# Altium project MOTION_BOARD.PrjPcb (part 2 of 2)

## Sheet DSP.SchDoc: DSP
size A2; ApprovedBy: Yves Chevallier; CheckedBy: Yves Chevallier; Author: Yves Chevallier; CompanyName: EPFL; DrawnBy: Yves Chevallier; Engineer: Yves Chevallier; Organization: EPFL; Address1: EPFL; Address2: CH1015 Lausanne; Address3: +41(0)21 693 36 98; Address4: +41(0)21 693 26 00; DocumentNumber: ABC.00.0000.000.0; Revision: v1.0; SheetNumber: 0; SheetTotal: 0; DrawnByDate: 2000-01-01; ExecutionWarrantDate: 2000-01-01; ExecutionWarrant: Yves Chevallier; Context: Confidential; PageSetup: Record=PageOptions|CenterHorizontal=True|CenterVertical=False|PrintScale=0.97|XCorrection=1.00|YCorrection=1.00|PrintKind=0|BorderSize=5000000|LeftOffset=0|BottomOffset=0|Orientation=2|PaperLength=1000|PaperWidth=1000|Scale=100|PaperSource=262|PrintQuality=600|MediaType=1|DitherType=10|PaperKind=A4|PrintScaleMode=1; EngineerDate: 2000-01-01; CheckedByDate: 2000-01-01; ProjectName: PRJ
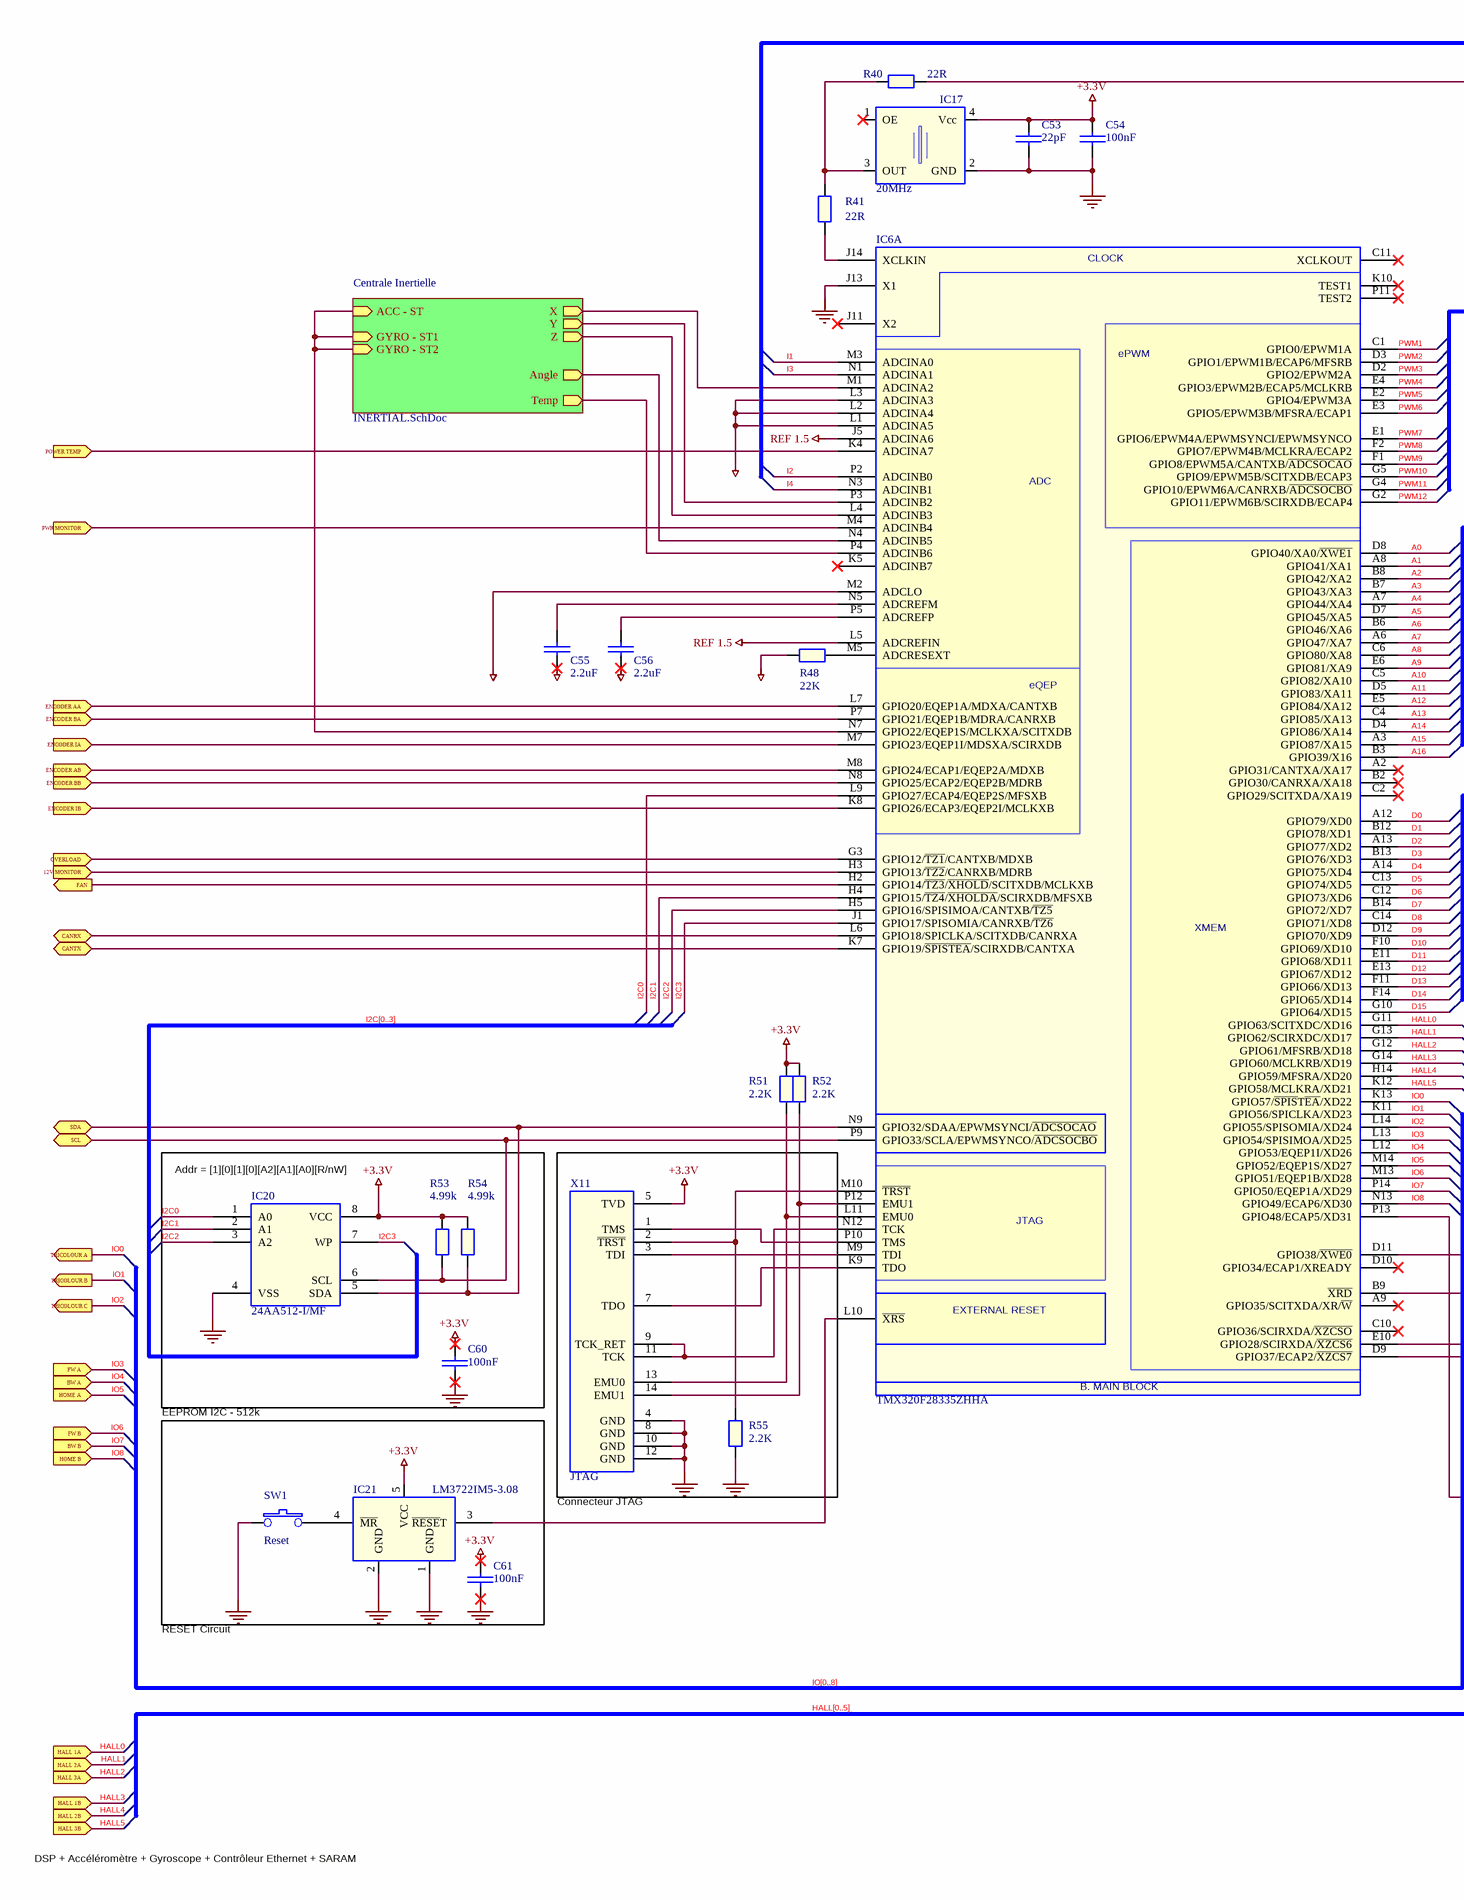
[diagram p5: DSP.SchDoc, left]
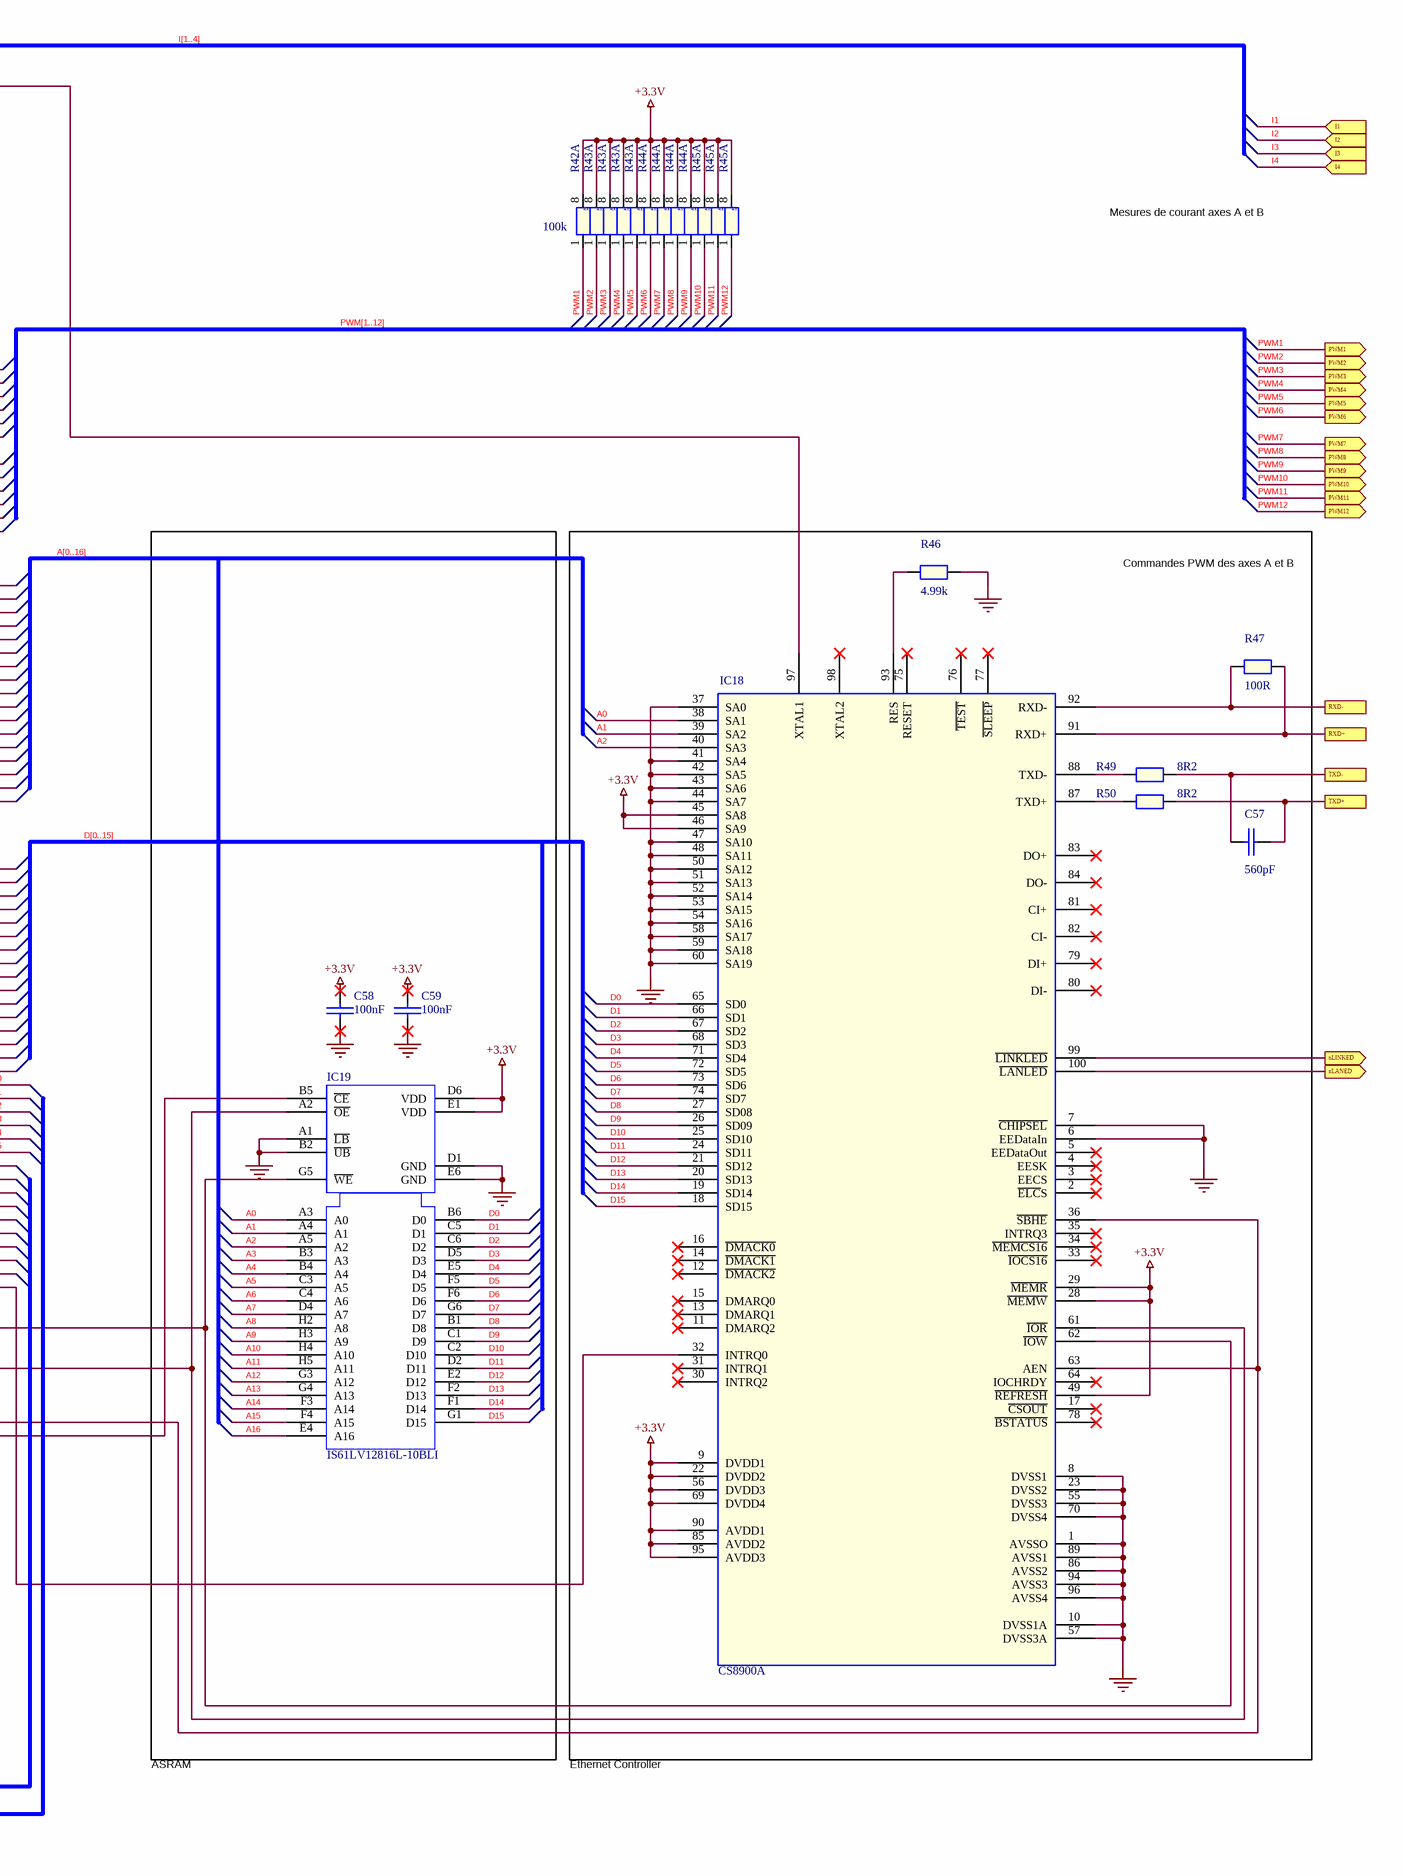
[diagram p6: DSP.SchDoc, right]

### Parts
(Parts that share a designator on the sheet are numbered #1, #2 ... from top to bottom, then left to right.)
C53  22pF  [SM/C_0805]
C54  100nF  [SM/C_0805]
C55  2.2uF  [SM/C_0805]
C56  2.2uF  [SM/C_0805]
C57  560pF  [SM/C_0805]
C58  100nF  [SM/C_0805]
C59  100nF  [SM/C_0805]
C60  100nF  [SM/C_0805]
C61  100nF  [SM/C_0805]
IC6  TMX320F28335ZHHA  [HEIG/BGA/MICROSTAR/S-PBGA-N179]  (part A of 2)
IC17  20MHz  [HEIG/OSC/SPX0/SG-310]
IC18  CS8900A  [QUAD.50M/100/WG16.00]
IC19  IS61LV12816L-10BLI  [HEIG/BGA/0.8/6H/48/6X8]
IC20  24AA512-I/MF  [HEIG/DFN/8/6X5]
IC21  LM3722IM5-3.08  [HEIG/SM/SOT23-5]
R40  22R  [R400]
R41  22R  [R400]
R42  100k  [RESEAU_CAY16_710958]  (part A of 4)
R43#1  R 4x  [RESEAU_CAY16_710958]  (value not drawn)  (part A of 4)
R43#2  R 4x  [RESEAU_CAY16_710958]  (value not drawn)  (part A of 4)
R43#3  R 4x  [RESEAU_CAY16_710958]  (value not drawn)  (part A of 4)
R43#4  R 4x  [RESEAU_CAY16_710958]  (value not drawn)  (part A of 4)
R44#1  R 4x  [RESEAU_CAY16_710958]  (value not drawn)  (part A of 4)
R44#2  R 4x  [RESEAU_CAY16_710958]  (value not drawn)  (part A of 4)
R44#3  R 4x  [RESEAU_CAY16_710958]  (value not drawn)  (part A of 4)
R44#4  R 4x  [RESEAU_CAY16_710958]  (value not drawn)  (part A of 4)
R45#1  R 4x  [RESEAU_CAY16_710958]  (value not drawn)  (part A of 4)
R45#2  R 4x  [RESEAU_CAY16_710958]  (value not drawn)  (part A of 4)
R45#3  R 4x  [RESEAU_CAY16_710958]  (value not drawn)  (part A of 4)
R46  4.99k  [R400]
R47  100R  [R400]
R48  22K  [R400]
R49  8R2  [R400]
R50  8R2  [R400]
R51  2.2K  [R400]
R52  2.2K  [R400]
R53  4.99k  [R400]
R54  4.99k  [R400]
R55  2.2K  [R400]
SW1  Reset  [PUSHBUTTON_415 6535]
X11  JTAG  [HEIG/CONN/SMT14]

### Blocks framed on the sheet
Commandes PWM des axes A et B: C57 IC18 R46 R47 R49 R50
Addr = [1][0][1][0][A2][A1][A0][R/nW]: C60 IC20 R53 R54
EEPROM I2C - 512k: C61 IC21 SW1

### Sub-sheets
Centrale Inertielle = INERTIAL.SchDoc: X (out), Y (out), Z (out), Angle (out), ACC - ST (in), GYRO - ST1 (in), GYRO - ST2 (in), Temp (out)

### Ports
12V MONITOR (in), BW A (in), BW B (in), CANRX (bidir), CANTX (bidir), ENCODER AA (in), ENCODER AB (in), ENCODER BA (in), ENCODER BB (in), ENCODER IA (in), ENCODER IB (in), FAN (out), FW A (in), FW B (in), HALL 1A (in), HALL 1B (in), HALL 2A (in), HALL 2B (in), HALL 3A (in), HALL 3B (in), HOME A (in), HOME B (in), I1 (in), I2 (in), I3 (in), I4 (in), nLANED (out), nLINKED (out), OVERLOAD (in), POWER TEMP (in), PWM1 (out), PWM2 (out), PWM3 (out), PWM4 (out), PWM5 (out), PWM6 (out), PWM7 (out), PWM8 (out), PWM9 (out), PWM10 (out), PWM11 (out), PWM12 (out), PWR MONITOR (in), RXD+, RXD-, SCL (bidir), SDA (bidir), TRICOLOUR A (out), TRICOLOUR B (out), TRICOLOUR C (out), TXD+, TXD-

### Nets
+3.3V: C53.1 C54.1 C58.1 C59.1 C60.1 C61.1 IC17.4(Vcc) IC18.9(DVDD1) IC18.22(DVDD2) IC18.28(~{MEMW}) IC18.29(~{MEMR}) IC18.45(SA8) IC18.46(SA9) IC18.49(~{REFRESH}) IC18.56(DVDD3) IC18.69(DVDD4) IC18.85(AVDD2) IC18.90(AVDD1) IC18.95(AVDD3) IC19.D6(VDD) IC19.E1(VDD) IC20.8(VCC) IC21.5(VCC) R42.8(B) R43#1.8(B) R43#2.8(B) R43#3.8(B) R43#4.8(B) R44#1.8(B) R44#2.8(B) R44#3.8(B) R44#4.8(B) R45#1.8(B) R45#2.8(B) R45#3.8(B) R51.1 R52.1 R53.1 R54.1 X11.5(TVD)
AGND: C55.2 C56.2 IC6.L1(ADCINA5) IC6.L2(ADCINA4) IC6.L3(ADCINA3) IC6.M2(ADCLO) R48.1
GND: C53.2 C54.2 C58.2 C59.2 C60.2 C61.2 IC6.J13(X1) IC17.2(GND) IC18.1(AVSSO) IC18.6(EEDataIn) IC18.7(~{CHIPSEL}) IC18.8(DVSS1) IC18.10(DVSS1A) IC18.23(DVSS2) IC18.37(SA0) IC18.41(SA4) IC18.42(SA5) IC18.43(SA6) IC18.44(SA7) IC18.47(SA10) IC18.48(SA11) IC18.50(SA12) IC18.51(SA13) IC18.52(SA14) IC18.53(SA15) IC18.54(SA16) IC18.55(DVSS3) IC18.57(DVSS3A) IC18.58(SA17) IC18.59(SA18) IC18.60(SA19) IC18.70(DVSS4) IC18.86(AVSS2) IC18.89(AVSS1) IC18.94(AVSS3) IC18.96(AVSS4) IC19.A1(~{LB}) IC19.B2(~{UB}) IC19.D1(GND) IC19.E6(GND) IC20.4(VSS) IC21.1(GND) IC21.2(GND) R46.2 R55.2 SW1.2 X11.4(GND) X11.8(GND) X11.10(GND) X11.12(GND)
REF 1.5: IC6.J5(ADCINA6) IC6.L5(ADCREFIN)
12V MONITOR: IC6.H3(GPIO13/~{TZ2}/CANRXB/MDRB) ; port 12V MONITOR
A0: IC6.D8(GPIO40/XA0/~{XWE1}) IC18.38(SA1) IC19.A3(A0)
A1: IC6.A8(GPIO41/XA1) IC18.39(SA2) IC19.A4(A1)
A2: IC6.B8(GPIO42/XA2) IC18.40(SA3) IC19.A5(A2)
A3: IC6.B7(GPIO43/XA3) IC19.B3(A3)
A4: IC6.A7(GPIO44/XA4) IC19.B4(A4)
A5: IC6.D7(GPIO45/XA5) IC19.C3(A5)
A6: IC6.B6(GPIO46/XA6) IC19.C4(A6)
A7: IC6.A6(GPIO47/XA7) IC19.D4(A7)
A8: IC6.C6(GPIO80/XA8) IC19.H2(A8)
A9: IC6.E6(GPIO81/XA9) IC19.H3(A9)
A10: IC6.C5(GPIO82/XA10) IC19.H4(A10)
A11: IC6.D5(GPIO83/XA11) IC19.H5(A11)
A12: IC6.E5(GPIO84/XA12) IC19.G3(A12)
A13: IC6.C4(GPIO85/XA13) IC19.G4(A13)
A14: IC6.D4(GPIO86/XA14) IC19.F3(A14)
A15: IC6.A3(GPIO87/XA15) IC19.F4(A15)
A16: IC6.B3(GPIO39/X16) IC19.E4(A16)
D0: IC6.A12(GPIO79/XD0) IC18.65(SD0) IC19.B6(D0)
D1: IC6.B12(GPIO78/XD1) IC18.66(SD1) IC19.C5(D1)
D2: IC6.A13(GPIO77/XD2) IC18.67(SD2) IC19.C6(D2)
D3: IC6.B13(GPIO76/XD3) IC18.68(SD3) IC19.D5(D3)
D4: IC6.A14(GPIO75/XD4) IC18.71(SD4) IC19.E5(D4)
D5: IC6.C13(GPIO74/XD5) IC18.72(SD5) IC19.F5(D5)
D6: IC6.C12(GPIO73/XD6) IC18.73(SD6) IC19.F6(D6)
D7: IC6.B14(GPIO72/XD7) IC18.74(SD7) IC19.G6(D7)
D8: IC6.C14(GPIO71/XD8) IC18.27(SD08) IC19.B1(D8)
D9: IC6.D12(GPIO70/XD9) IC18.26(SD09) IC19.C1(D9)
D10: IC6.F10(GPIO69/XD10) IC18.25(SD10) IC19.C2(D10)
D11: IC6.E11(GPIO68/XD11) IC18.24(SD11) IC19.D2(D11)
D12: IC6.E13(GPIO67/XD12) IC18.21(SD12) IC19.E2(D12)
D13: IC6.F11(GPIO66/XD13) IC18.20(SD13) IC19.F2(D13)
D14: IC6.F14(GPIO65/XD14) IC18.19(SD14) IC19.F1(D14)
D15: IC6.G10(GPIO64/XD15) IC18.18(SD15) IC19.G1(D15)
HALL0: IC6.G11(GPIO63/SCITXDC/XD16) ; port HALL 1A
HALL1: IC6.G13(GPIO62/SCIRXDC/XD17) ; port HALL 2A
HALL2: IC6.G12(GPIO61/MFSRB/XD18) ; port HALL 3A
HALL3: IC6.G14(GPIO60/MCLKRB/XD19) ; port HALL 1B
HALL4: IC6.H14(GPIO59/MFSRA/XD20) ; port HALL 2B
HALL5: IC6.K12(GPIO58/MCLKRA/XD21) ; port HALL 3B
I1: IC6.M3(ADCINA0) ; port I1
I2: IC6.P2(ADCINB0) ; port I2
I2C0: IC6.L9(GPIO27/ECAP4/EQEP2S/MFSXB) IC20.1(A0)
I2C1: IC6.H4(GPIO15/~{TZ4}/~{XHOLDA}/SCIRXDB/MFSXB) IC20.2(A1)
I2C2: IC6.H5(GPIO16/SPISIMOA/CANTXB/~{TZ5}) IC20.3(A2)
I2C3: IC6.J1(GPIO17/SPISOMIA/CANRXB/~{TZ6}) IC20.7(WP)
I3: IC6.N1(ADCINA1) ; port I3
I4: IC6.N3(ADCINB1) ; port I4
IO0: IC6.K13(GPIO57/~{SPIS}T~{EA}/XD22) ; port TRICOLOUR A
IO1: IC6.K11(GPIO56/SPICLKA/XD23) ; port TRICOLOUR B
IO2: IC6.L14(GPIO55/SPISOMIA/XD24) ; port TRICOLOUR C
IO3: IC6.L13(GPIO54/SPISIMOA/XD25) ; port FW A
IO4: IC6.L12(GPIO53/EQEP1I/XD26) ; port BW A
IO5: IC6.M14(GPIO52/EQEP1S/XD27) ; port HOME A
IO6: IC6.M13(GPIO51/EQEP1B/XD28) ; port FW B
IO7: IC6.P14(GPIO50/EQEP1A/XD29) ; port BW B
IO8: IC6.N13(GPIO49/ECAP6/XD30) ; port HOME B
OVERLOAD: IC6.G3(GPIO12/~{TZ1}/CANTXB/MDXB) ; port OVERLOAD
PWM1: IC6.C1(GPIO0/EPWM1A) R42.1(A) ; port PWM1
PWM2: IC6.D3(GPIO1/EPWM1B/ECAP6/MFSRB) R43#1.1(A) ; port PWM2
PWM3: IC6.D2(GPIO2/EPWM2A) R43#2.1(A) ; port PWM3
PWM4: IC6.E4(GPIO3/EPWM2B/ECAP5/MCLKRB) R43#3.1(A) ; port PWM4
PWM5: IC6.E2(GPIO4/EPWM3A) R43#4.1(A) ; port PWM5
PWM6: IC6.E3(GPIO5/EPWM3B/MFSRA/ECAP1) R44#1.1(A) ; port PWM6
PWM7: IC6.E1(GPIO6/EPWM4A/EPWMSYNCI/EPWMSYNCO) R44#2.1(A) ; port PWM7
PWM8: IC6.F2(GPIO7/EPWM4B/MCLKRA/ECAP2) R44#3.1(A) ; port PWM8
PWM9: IC6.F1(GPIO8/EPWM5A/CANTXB/~{ADCSOCAO}) R44#4.1(A) ; port PWM9
PWM10: IC6.G5(GPIO9/EPWM5B/SCITXDB/ECAP3) R45#1.1(A) ; port PWM10
PWM11: IC6.G4(GPIO10/EPWM6A/CANRXB/~{ADCSOCBO}) R45#2.1(A) ; port PWM11
PWM12: IC6.G2(GPIO11/EPWM6B/SCIRXDB/ECAP4) R45#3.1(A) ; port PWM12
PWR MONITOR: IC6.M4(ADCINB4) ; port PWR MONITOR
NetC51_1: IC6.K4(ADCINA7) ; port POWER TEMP
NetC55_1: C55.1 IC6.N5(ADCREFM)
NetC56_1: C56.1 IC6.P5(ADCREFP)
NetC57_1: C57.1 R49.2 ; port TXD-
NetC57_2: C57.2 R50.2 ; port TXD+
NetC63_1: IC6.M1(ADCINA2) ; sheet Centrale Inertielle/X
NetC65_1: IC6.P3(ADCINB2) ; sheet Centrale Inertielle/Y
NetC68_1: IC6.L4(ADCINB3) ; sheet Centrale Inertielle/Z
NetIC6_B9: IC6.B9(~{XRD}) IC18.61(~{IOR}) IC19.A2(~{OE})
NetIC6_D9: IC6.D9(GPIO37/ECAP2/~{XZCS7}) IC19.B5(~{CE})
NetIC6_D11: IC6.D11(GPIO38/~{XWE0}) IC18.62(~{IOW}) IC19.G5(~{WE})
NetIC6_E10: IC6.E10(GPIO28/SCIRXDA/~{XZCS6}) IC18.36(~{SBHE}) IC18.63(AEN)
NetIC6_H2: IC6.H2(GPIO14/~{TZ3}/~{XHOLD}/SCITXDB/MCLKXB) ; port FAN
NetIC6_J14: IC6.J14(XCLKIN) R41.1
NetIC6_K7: IC6.K7(GPIO19/~{SPISTEA}/SCIRXDB/CANTXA) ; port CANTX
NetIC6_K8: IC6.K8(GPIO26/ECAP3/EQEP2I/MCLKXB) ; port ENCODER IB
NetIC6_K9: IC6.K9(TDO) X11.7(TDO)
NetIC6_L6: IC6.L6(GPIO18/SPICLKA/SCITXDB/CANRXA) ; port CANRX
NetIC6_L7: IC6.L7(GPIO20/EQEP1A/MDXA/CANTXB) ; port ENCODER AA
NetIC6_L10: IC6.L10(~{XRS}) IC21.3(~{RESE}T)
NetIC6_L11: IC6.L11(EMU0) R51.2 X11.13(EMU0)
NetIC6_M5: IC6.M5(ADCRESEXT) R48.2
NetIC6_M7: IC6.M7(GPIO23/EQEP1I/MDSXA/SCIRXDB) ; port ENCODER IA
NetIC6_M8: IC6.M8(GPIO24/ECAP1/EQEP2A/MDXB) ; port ENCODER AB
NetIC6_M9: IC6.M9(TDI) X11.3(TDI)
NetIC6_M10: IC6.M10(~{TRST}) R55.1 X11.2(~{TRST})
NetIC6_N4: IC6.N4(ADCINB5) ; sheet Centrale Inertielle/Angle
NetIC6_N7: IC6.N7(GPIO22/EQEP1S/MCLKXA/SCITXDB) ; sheet Centrale Inertielle/ACC - ST, sheet Centrale Inertielle/GYRO - ST1, sheet Centrale Inertielle/GYRO - ST2
NetIC6_N8: IC6.N8(GPIO25/ECAP2/EQEP2B/MDRB) ; port ENCODER BB
NetIC6_N9: IC6.N9(GPIO32/SDAA/EPWMSYNCI/~{ADCSOCAO}) IC20.5(SDA) R54.2 ; port SDA
NetIC6_N12: IC6.N12(TCK) X11.9(TCK_RET) X11.11(TCK)
NetIC6_P4: IC6.P4(ADCINB6) ; sheet Centrale Inertielle/Temp
NetIC6_P7: IC6.P7(GPIO21/EQEP1B/MDRA/CANRXB) ; port ENCODER BA
NetIC6_P9: IC6.P9(GPIO33/SCLA/EPWMSYNCO/~{ADCSOCBO}) IC20.6(SCL) R53.2 ; port SCL
NetIC6_P10: IC6.P10(TMS) X11.1(TMS)
NetIC6_P12: IC6.P12(EMU1) R52.2 X11.14(EMU1)
NetIC6_P13: IC6.P13(GPIO48/ECAP5/XD31) IC18.32(INTRQ0)
NetIC17_3: IC17.3(OUT) R40.2 R41.2
NetIC18_87: IC18.87(TXD+) R50.1
NetIC18_88: IC18.88(TXD-) R49.1
NetIC18_91: IC18.91(RXD+) R47.2 ; port RXD+
NetIC18_92: IC18.92(RXD-) R47.1 ; port RXD-
NetIC18_93: IC18.93(RES) R46.1
NetIC18_97: IC18.97(XTAL1) R40.1
NetIC18_99: IC18.99(~{LINKLED}) ; port nLINKED
NetIC18_100: IC18.100(~{LANLED}) ; port nLANED
NetIC21_4: IC21.4(~{MR}) SW1.1

Not connected (* = marked no-connect by the designer): IC6 A2(GPIO31/CANTXA/XA17)* A9(GPIO35/SCITXDA/XR/~{W})* B2(GPIO30/CANRXA/XA18)* C2(GPIO29/SCITXDA/XA19)* C10(GPIO36/SCIRXDA/~{XZCSO})* C11(XCLKOUT)* D10(GPIO34/ECAP1/XREADY)* J11(X2)* K5(ADCINB7)* K10(TEST1)* P11(TEST2)*; IC17 1(OE)*; IC18 2(~{ELC}S)* 3(EECS)* 4(EESK)* 5(EEDataOut)* 11(DMARQ2)* 12(~{DMACK2})* 13(DMARQ1)* 14(~{DMACK1})* 15(DMARQ0)* 16(~{DMACK0})* 17(~{CSOUT})* 30(INTRQ2)* 31(INTRQ1)* 33(~{IOCS16})* 34(~{MEMCS16})* 35(INTRQ3)* 64(IOCHRDY)* 75(RESET)* 76(~{TEST})* 77(~{SLEEP})* 78(~{BSTATUS})* 79(DI+)* 80(DI-)* 81(CI+)* 82(CI-)* 83(DO+)* 84(DO-)* 98(XTAL2)*

### Buses and harness runs
bus A[0..16]
bus D[0..15]
bus HALL[0..5]
bus I2C[0..3]
bus I[1..4]
bus IO[0..8]
bus PWM[1..12]

### Notes on the sheet
- Mesures de courant axes A et B
- (near X11) Connecteur JTAG
- RESET Circuit
- ASRAM
- Ethernet Controller
- DSP + Accéléromètre + Gyroscope + Contrôleur Ethernet + SARAM
- Title
- HES-SO / HEIG-VD / TIN / IAI
  Route de Cheseaux, 1
  CH-1401 Yverdon-les-Bains
  T +41 24 557 73 77    F +41 24 557 63 20
  http://iai.heig-vd.ch
  iai@heig-vd.ch
- Size
- Date
- File
- A4
- Project
- Sheet
- of
- No.
- Author
- SVN/Git
- Version
- (in symbol R 4x, part A) 4x
- (in symbol TMS320F2833xZHH, part A) CLOCK; ePWM; ADC; eQEP; XMEM; JTAG; EXTERNAL RESET; B. MAIN BLOCK

### Library data of the parts
C53 = C_Dup1: PCB Footprint: HEIG/SM/C_0603; Prix Unitaire: 0.14; Référence: 499-687; Ref. Fab: AVX; Prix: 0.098; Ref. Fabricant: 06035A220JAT2A; Quantité min: 10; Distributor: Farnell; Ref. Distributor: 499-687; Price in €: 0.140; Distributeur: Farnell; Ref. Distributeur: 498543; Fabricant: AVX
C54 C58 C59 = C_Dup1: PCB Footprint: HEIG/SM/C_0603; Quantité min: 10; Fabricant: PHYCOMP; Ref. Fabricant: 2238 786 15649; Prix: 0.06; Ref. Fab: AVX; Référence: 499-687; Prix Unitaire: 0.14; Ref. Distributeur: 432210; Distributeur: Farnell; Price in €: 0.140; Ref. Distributor: 499-687; Distributor: Farnell
C55 C56 = C_Dup1: Ref. Fabricant: C0805C225K8PAC; Prix: 0.474; Ref. Fab: AVXMCCTA106M006.MULTICOMP; VOLTAGE: 10V; Référence: 757-720; Prix Unitaire: 0.40; fab: B45196-E2225K109; Fabricant: KEMET; Quantité min: 10; Distributeur: Farnell; Ref. Distributeur: 9227822; Price in €: 0.87; Ref. Distributor: 967-014; Distributor: Farnell; PCB Footprint: SM/C_0805
C57 = C_Dup1: PCB Footprint: HEIG/SM/C_0603; Prix Unitaire: 0.14; Référence: 499-687; Ref. Fab: AVX; Prix: 0.113; Ref. Fabricant: 2238 586 15619; Fabricant: PHYCOMP; Quantité min: 10; Voltage: 50V; Distributor: Farnell; Ref. Distributor: 499-687; Price in €: 0.140; Distributeur: Farnell; Ref. Distributeur: 3019640
C60 C61 = C_Dup1: PCB Footprint: HEIG/SM/C_0603; Prix Unitaire: 0.14; Référence: 499-687; Ref. Fab: AVX; Prix: 0.06; Ref. Fabricant: 2238 786 15649; Fabricant: PHYCOMP; Quantité min: 10; Distributor: Farnell; Ref. Distributor: 499-687; Price in €: 0.140; Distributeur: Farnell; Ref. Distributeur: 432210
IC6 = TMS320F2833xZHH: Prix: 94.45; Fabricant: TEXAS INSTRUMENTS; Quantité min: 1; PCB Footprint: HEIG/BGA/MICROSTAR/S-PBGA-N179; Distributeur: Farnell; Ref. Distributeur: 1503814; Ref. Fabricant: TMX320F28335ZHHA
IC17 = Xtal Oscillateur: Fabricant: EPSON TOYOCOM; Ref. Fabricant: SG-310 SCF C 20.0MHZ; Prix: 5.50; Voltage: 3.3V; Quantité min: 1; Tolérance: 100ppm; PCB Footprint: HEIG/OSC/SPX0/SG-310; Distributeur: Farnell; Ref. Distributeur: 1278064
IC18 = CS8900A: Quantité min: 1; Prix: 16.60; Ref. Fabricant: CS8900A-CQ3Z; Fabricant: CIRRUS LOGIC; Distributeur: Farnell; Ref. Distributeur: 1023455; PCB Footprint: QUAD.50M/100/WG16.00
IC19 = IS61LV12816L: Quantité min: 1; Prix: 12.85; Fabricant: INTEGRATED SILICON SOLUTIONS; PCB Footprint: HEIG/BGA/0.8/6H/48/6X8; Ref. Fabricant: IS61LV12816L-10BLI; Ref. Distributeur: 1472387; Distributeur: Farnell
IC20 = 24LC32A_0: Prix: 6.75; Fabricant: MICROCHIP; Ref. Distributeur: 1331299; Distributeur: Farnell; Ref. Fabricant: 24AA512-I/MF; PCB Footprint: HEIG/DFN/8/6X5
IC21 = LM3722_0: Ref. Fab: LM3722IM5-3.08... NATIONAL SEMICONDUCTOR; Prix: 5.50; Fabricant: NATIONAL SEMICONDUCTOR; Quantité min: 1; PCB Footprint: HEIG/SM/SOT23-5; Price in €: 1.94; Ref. Distributor: 4124972; Distributor: Farnell; Distributeur: Farnell; Ref. Distributeur: 9779019; Ref. Fabricant: LM3722IM5-3.08
R40 = R_Dup1: Prix: 0.064; Ref. Fabricant: MC 0.063W 0603 5% 22R; Fabricant: MULTICOMP; Quantité min: 50; PCB Footprint: HEIG/SM/R_0603; Ref. Distributeur: 9331891; Distributeur: Farnell
R41 = R_Dup1: Quantité min: 50; Fabricant: MULTICOMP; Ref. Fabricant: MC 0.063W 0603 5% 22R; Prix: 0.064; PCB Footprint: HEIG/SM/R_0603; Distributeur: Farnell; Ref. Distributeur: 9331891
R42 = R 4x: PCB Footprint: RESEAU_CAY16_710958
R46 = R_Dup1: PCB Footprint: HEIG/SM/R_0603; Prix: 0.065; Quantité min: 50; Tolérance: 1%; Fabricant: MULTICOMP; Ref. Fabricant: MC 0.063W 0603 1% 4K99; Distributeur: Farnell; Ref. Distributeur: 1170859
R47 = R_Dup1: PCB Footprint: HEIG/SM/R_0603; Prix: 0.113; Fabricant: PHYCOMP; Ref. Fabricant: 232270260101; Quantité min: 50; Distributeur: Farnell; Ref. Distributeur: 9233253
R48 = R: Ref. Fab: multicomp; Prix: 0.065; Ref. Fabricant: MC 0.063W 0603 5% 22K; PCB Footprint: HEIG/SM/R_0603; Quantité min: 50; Distributor: Farnell; Price in €: 0.037; Ref. Distributor: 613-861; Ref. Distributeur: 9331921; Distributeur: Farnell; Fabricant: MULTICOMP
R49 = R_Dup1: PCB Footprint: HEIG/SM/R_0603; Prix: 0.123; Quantité min: 50; Tolérance: 1%; Fabricant: PHYCOMP; Ref. Fabricant: 232270468208; Distributeur: Farnell; Ref. Distributeur: 9238239
R50 = R_Dup1: PCB Footprint: HEIG/SM/R_0603; Fabricant: PHYCOMP; Ref. Fabricant: 232270468208; Prix: 0.123; Quantité min: 50; Tolérance: 1%; Distributeur: Farnell; Ref. Distributeur: 9238239
R51 R52 = R: PCB Footprint: HEIG/SM/R_0805; Prix: 0.065; Quantité min: 50; Tolérance: 5%; Fabricant: MULTICOMP; Ref. Fabricant: MC 0.1W 0805 5% 2K2; Distributeur: Farnell; Ref. Distributeur: 9334149
R53 R54 = R: PCB Footprint: HEIG/SM/R_0603; Prix: 0.065; Quantité min: 50; Tolérance: 1%; Fabricant: MULTICOMP; Ref. Fabricant: MC 0.063W 0603 1% 4K99; Distributeur: Farnell; Ref. Distributeur: 1170859
R55 = R: PCB Footprint: HEIG/SM/R_0805; Fabricant: MULTICOMP; Ref. Fabricant: MC 0.1W 0805 5% 2K2; Prix: 0.065; Quantité min: 50; Tolérance: 5%; Distributeur: Farnell; Ref. Distributeur: 9334149
SW1 = SW PUSHBUTTON_0: Fabricant: C & K; Ref. Fabricant: KSR221G LFS; Prix: 1.15; Quantité min: 1; PCB Footprint: PUSHBUTTON_415 6535; Ref. Distributeur: 1201421; Distributeur: Farnell
X11 = CON14_0: FPLIST: BLKCON.100/VH/TM2OE/W.200/14; Prix: 1.60; Ref. Fabricant: 1-1634688-4; Fabricant: TYCO ELECTRONICS / AMP; Quantité min: 1; Ref. Distributeur: 8395926; Distributeur: Farnell; PCB Footprint: HEIG/CONN/SMT14
R43#1-R43#4 R44#1-R44#4 R45#1-R45#3 = R 4x: PCB Footprint: RESEAU_CAY16_710958

## Sheet INERTIAL.SchDoc: IMU
size A4; ApprovedBy: Yves Chevallier; CheckedBy: Yves Chevallier; Author: Yves Chevallier; CompanyName: EPFL; DrawnBy: Yves Chevallier; Engineer: Yves Chevallier; Organization: EPFL; Address1: EPFL; Address2: CH1015 Lausanne; Address3: +41(0)21 693 36 98; Address4: +41(0)21 693 26 00; DocumentNumber: ABC.00.0000.000.0; Revision: v1.0; SheetNumber: 0; SheetTotal: 0; DrawnByDate: 2000-01-01; ExecutionWarrantDate: 2000-01-01; ExecutionWarrant: Yves Chevallier; Context: Confidential; PageSetup: Record=PageOptions|CenterHorizontal=True|CenterVertical=False|PrintScale=0.97|XCorrection=1.00|YCorrection=1.00|PrintKind=0|BorderSize=5000000|LeftOffset=0|BottomOffset=0|Orientation=2|PaperLength=1000|PaperWidth=1000|Scale=100|PaperSource=262|PrintQuality=600|MediaType=1|DitherType=10|PaperKind=A4|PrintScaleMode=1; EngineerDate: 2000-01-01; CheckedByDate: 2000-01-01; ProjectName: PRJ
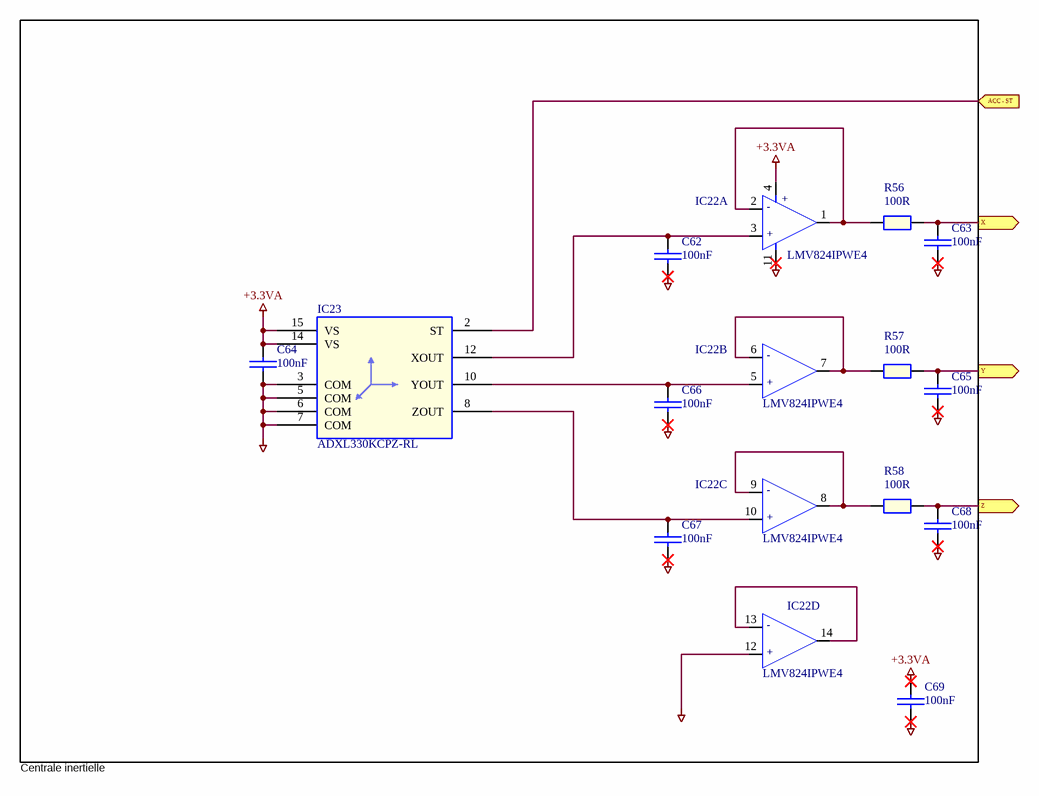
[diagram p7: INERTIAL.SchDoc]

### Parts
C62  100nF  [SM/C_0805]
C63  100nF  [SM/C_0805]
C64  100nF  [SM/C_0805]
C65  100nF  [SM/C_0805]
C66  100nF  [SM/C_0805]
C67  100nF  [SM/C_0805]
C68  100nF  [SM/C_0805]
C69  100nF  [SM/C_0805]
IC22  LMV824IPWE4  [HEIG/SM/TSSOP14]  (parts A,B,C,D of 4)
IC23  ADXL330KCPZ-RL  [HEIG/IC/ADXL330]
R56  100R  [R400]
R57  100R  [R400]
R58  100R  [R400]

### Ports
ACC - ST (in), X (out), Y (out), Z (out)

### Nets
+3.3VA: C64.1 C69.1 IC22.4(V+) IC23.14(VS) IC23.15(VS)
AGND: C62.2 C63.2 C64.2 C65.2 C66.2 C67.2 C68.2 C69.2 IC22.11(V-) IC22.12(+IN_D) IC23.3(COM) IC23.5(COM) IC23.6(COM) IC23.7(COM)
NetC62_1: C62.1 IC22.3(+IN_A) IC23.12(XOUT)
NetC63_1: C63.1 R56.2 ; port X
NetC65_1: C65.1 R57.2 ; port Y
NetC66_1: C66.1 IC22.5(+IN_B) IC23.10(YOUT)
NetC67_1: C67.1 IC22.10(+IN_C) IC23.8(ZOUT)
NetC68_1: C68.1 R58.2 ; port Z
NetIC6_N7: IC23.2(ST) ; port ACC - ST
NetIC22_1: IC22.1(OUT_A) IC22.2(-IN_A) R56.1
NetIC22_6: IC22.6(-IN_B) IC22.7(OUT_B) R57.1
NetIC22_8: IC22.8(OUT_C) IC22.9(-IN_C) R58.1
NetIC22_13: IC22.13(-IN_D) IC22.14(OUT_D)

### Notes on the sheet
- Centrale inertielle
- HES-SO / HEIG-VD / TIN / IAI
  Route de Cheseaux, 1
  CH-1401 Yverdon-les-Bains
  T +41 24 557 73 77    F +41 24 557 63 20
  http://iai.heig-vd.ch
  iai@heig-vd.ch
- Title
- Size
- Date
- A4
- Project
- Sheet
- of
- No.
- Author
- SVN/Git
- Version
- File
- (in symbol AD8609_0, part A) +; -
- (in symbol AD8609_0, part B) -; +
- (in symbol AD8609_0, part C) -; +
- (in symbol AD8609_0, part D) -; +

### Library data of the parts
C62 C63 C65-C67 C69 = C_Dup1: Prix Unitaire: 0.14; Référence: 499-687; Ref. Fab: AVX; Prix: 0.06; Ref. Fabricant: 2238 786 15649; Fabricant: PHYCOMP; Quantité min: 10; PCB Footprint: HEIG/SM/C_0603; Distributor: Farnell; Ref. Distributor: 499-687; Price in €: 0.140; Distributeur: Farnell; Ref. Distributeur: 432210
C64 C68 = C_Dup1: Quantité min: 10; Fabricant: PHYCOMP; Ref. Fabricant: 2238 786 15649; Prix: 0.06; Ref. Fab: AVX; Référence: 499-687; Prix Unitaire: 0.14; PCB Footprint: HEIG/SM/C_0603; Ref. Distributeur: 432210; Distributeur: Farnell; Price in €: 0.140; Ref. Distributor: 499-687; Distributor: Farnell
IC22 = AD8609_0: Prix: 1.90; Quantité min: 1; Fabricant: TEXAS INSTRUMENTS; PCB Footprint: HEIG/SM/TSSOP14; Distributeur: Farnell; Ref. Distributeur: 1053727; Ref. Fabricant: LMV824IPWE4
IC23 = ADXL330: Quantité min: 1; Prix: 23; Fabricant: ANALOG DEVICES; Distributeur: Farnell; Ref. Distributeur: 1274125; Ref. Fabricant: ADXL330KCPZ-RL; PCB Footprint: HEIG/IC/ADXL330
R56-R58 = R_Dup1: Quantité min: 50; Prix: 0.113; Ref. Fabricant: 232270260101; Fabricant: PHYCOMP; PCB Footprint: HEIG/SM/R_0603; Distributeur: Farnell; Ref. Distributeur: 9233253

## Sheet PWM.SchDoc: Inverter
size A3; ApprovedBy: Yves Chevallier; CheckedBy: Yves Chevallier; Author: Yves Chevallier; CompanyName: EPFL; DrawnBy: Yves Chevallier; Engineer: Yves Chevallier; Organization: EPFL; Address1: EPFL; Address2: CH1015 Lausanne; Address3: +41(0)21 693 36 98; Address4: +41(0)21 693 26 00; DocumentNumber: ABC.00.0000.000.0; Revision: v1.0; SheetNumber: 0; SheetTotal: 0; DrawnByDate: 2000-01-01; ExecutionWarrantDate: 2000-01-01; ExecutionWarrant: Yves Chevallier; Context: Confidential; PageSetup: Record=PageOptions|CenterHorizontal=True|CenterVertical=False|PrintScale=0.97|XCorrection=1.00|YCorrection=1.00|PrintKind=0|BorderSize=5000000|LeftOffset=0|BottomOffset=0|Orientation=2|PaperLength=1000|PaperWidth=1000|Scale=100|PaperSource=262|PrintQuality=600|MediaType=1|DitherType=10|PaperKind=A4|PrintScaleMode=1; EngineerDate: 2000-01-01; CheckedByDate: 2000-01-01; ProjectName: PRJ
Used 2 times, as channels H-Bridge3, H-Bridge2. Parts and nets are listed once, with the designators drawn on the sheet.
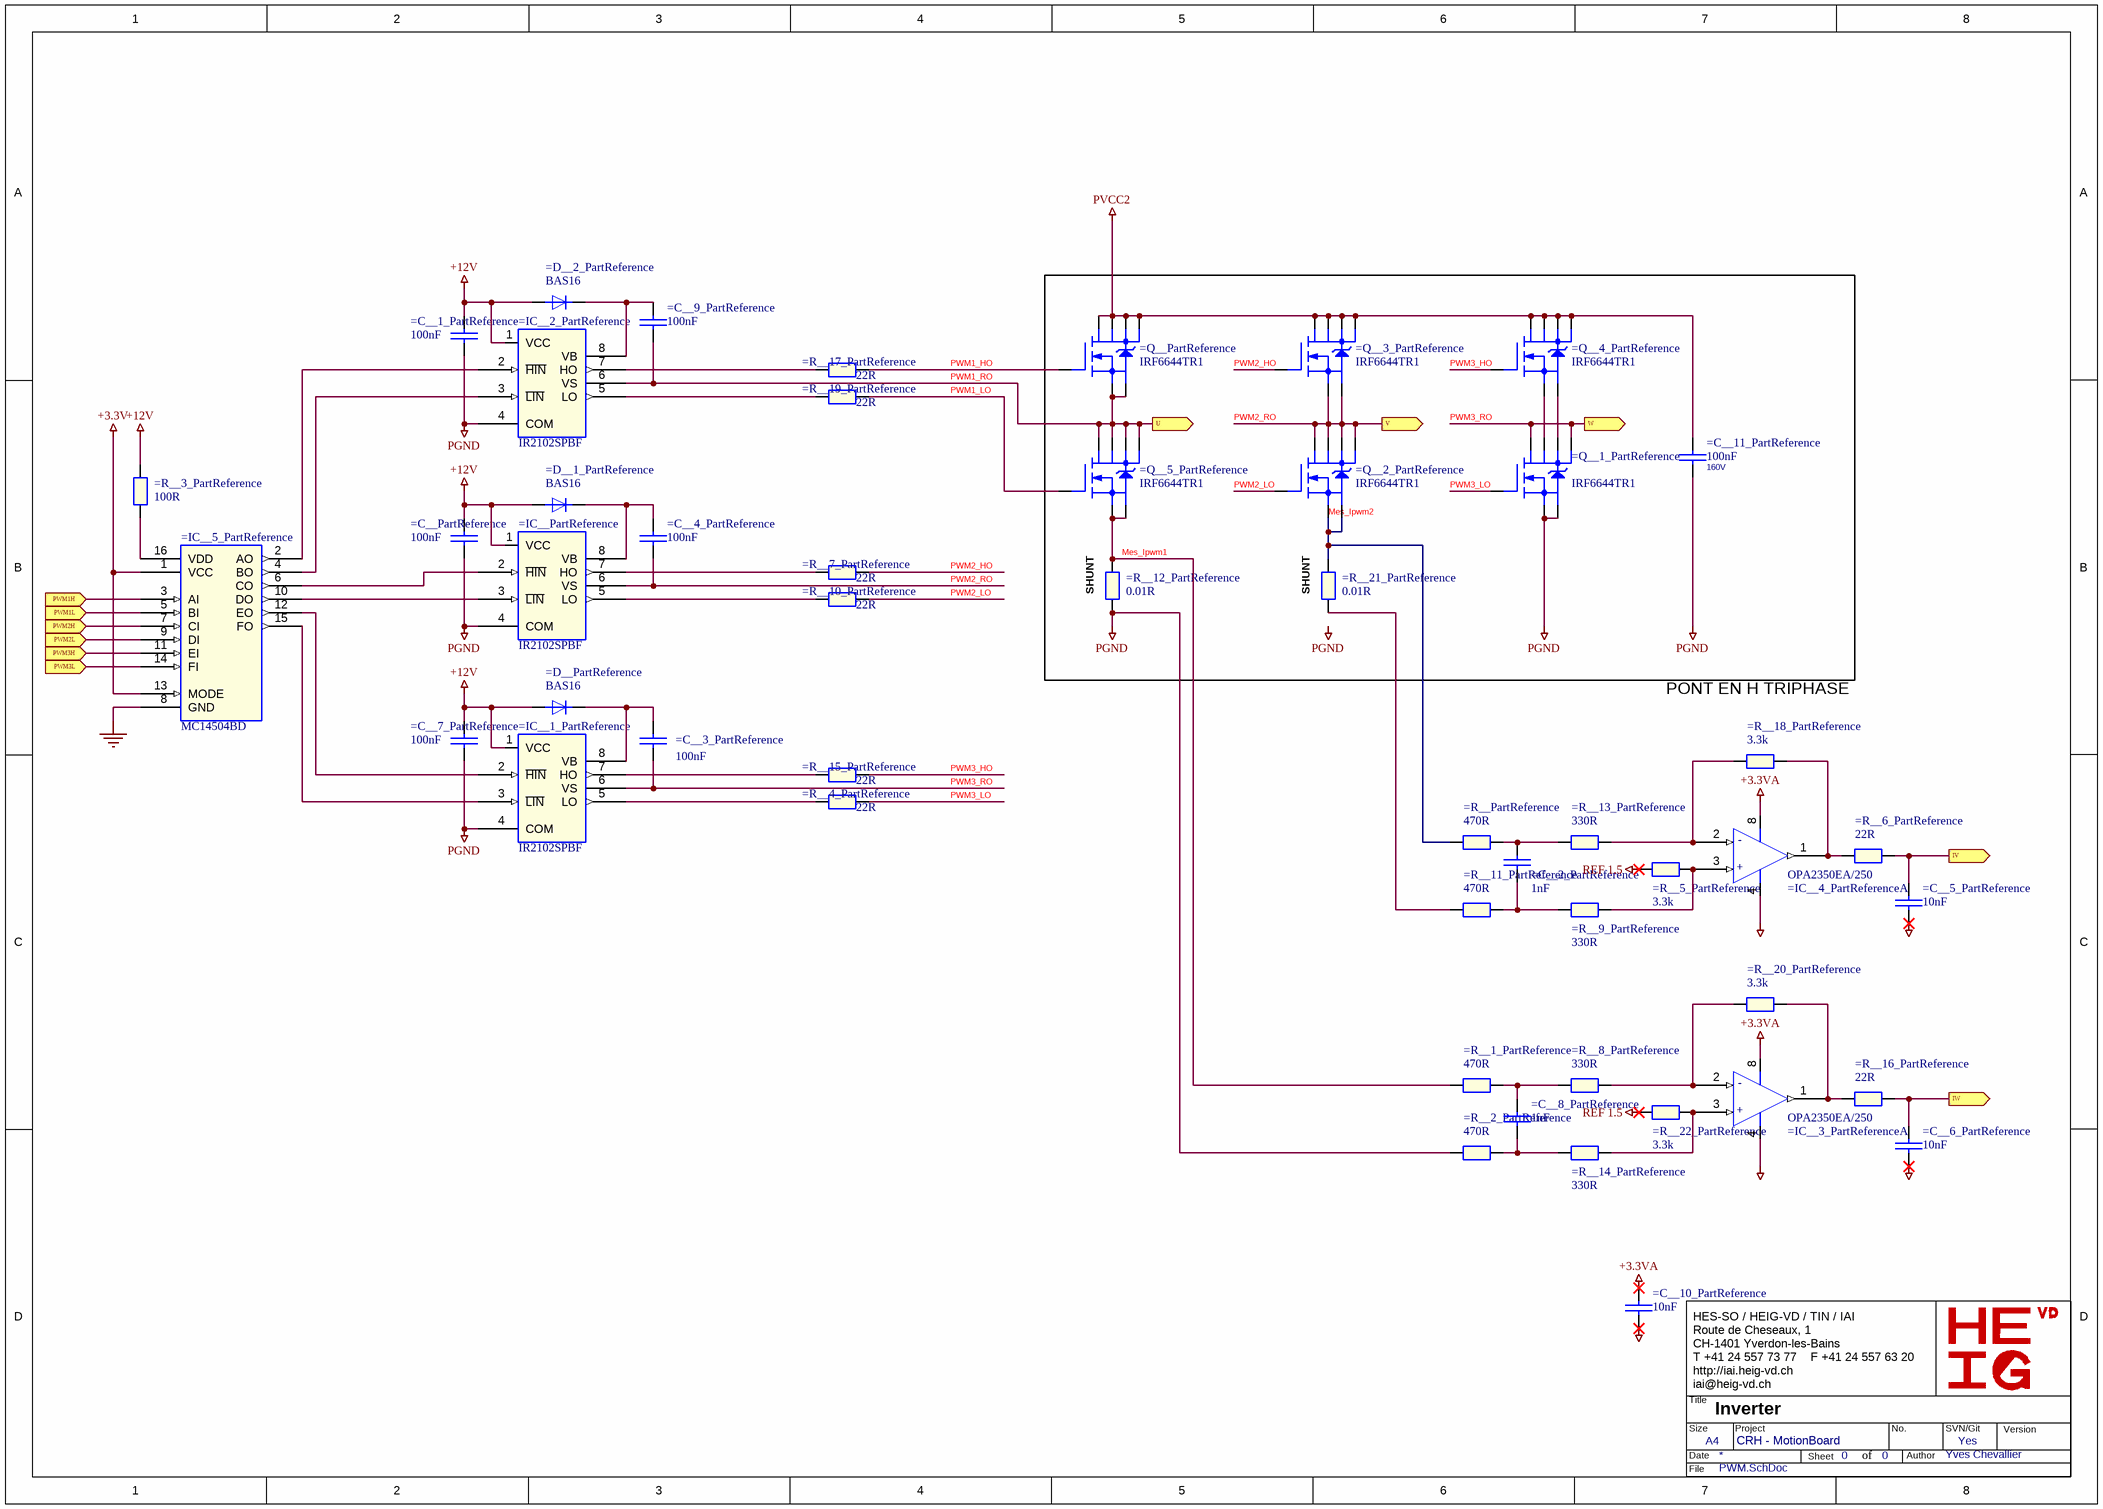
[diagram p8: PWM.SchDoc]

### Parts
=C__1_PartReference  100nF  [SM/C_0805]
=C__2_PartReference  1nF  [SM/C_0805]
=C__3_PartReference  100nF  [SM/C_0805]
=C__4_PartReference  100nF  [SM/C_0805]
=C__5_PartReference  10nF  [SM/C_0805]
=C__6_PartReference  10nF  [SM/C_0805]
=C__7_PartReference  100nF  [SM/C_0805]
=C__8_PartReference  1nF  [SM/C_0805]
=C__9_PartReference  100nF  [SM/C_0805]
=C__10_PartReference  10nF  [SM/C_0805]
=C__11_PartReference  100nF  VOLTAGE: 160V  [SM/C_0805]
=C__PartReference  100nF  [SM/C_0805]
=D__1_PartReference  BAS16  [HEIG/SM/SOT23]
=D__2_PartReference  BAS16  [HEIG/SM/SOT23]
=D__PartReference  BAS16  [HEIG/SM/SOT23]
=IC__1_PartReference  IR2102SPBF  [SOG.050/8/WG.244/L.200]
=IC__2_PartReference  IR2102SPBF  [SOG.050/8/WG.244/L.200]
=IC__3_PartReference  OPA2350EA/250  [HEIG/SM/MSOP8]  (part A of 2)
=IC__4_PartReference  OPA2350EA/250  [HEIG/SM/MSOP8]  (part A of 2)
=IC__5_PartReference  MC14504BD  [SOG.050/16/WG.244/L.400]
=IC__PartReference  IR2102SPBF  [SOG.050/8/WG.244/L.200]
=Q__1_PartReference  IRF6644TR1  [HEIG/DIRECTFET/MN]
=Q__2_PartReference  IRF6644TR1  [HEIG/DIRECTFET/MN]
=Q__3_PartReference  IRF6644TR1  [HEIG/DIRECTFET/MN]
=Q__4_PartReference  IRF6644TR1  [HEIG/DIRECTFET/MN]
=Q__5_PartReference  IRF6644TR1  [HEIG/DIRECTFET/MN]
=Q__PartReference  IRF6644TR1  [HEIG/DIRECTFET/MN]
=R__1_PartReference  470R  [R400]
=R__2_PartReference  470R  [R400]
=R__3_PartReference  100R  [R400]
=R__4_PartReference  22R  [R400]
=R__5_PartReference  3.3k  [R400]
=R__6_PartReference  22R  [R400]
=R__7_PartReference  22R  [R400]
=R__8_PartReference  330R  [R400]
=R__9_PartReference  330R  [R400]
=R__10_PartReference  22R  [R400]
=R__11_PartReference  470R  [R400]
=R__12_PartReference  0.01R  [R400]
=R__13_PartReference  330R  [R400]
=R__14_PartReference  330R  [R400]
=R__15_PartReference  22R  [R400]
=R__16_PartReference  22R  [R400]
=R__17_PartReference  22R  [R400]
=R__18_PartReference  3.3k  [R400]
=R__19_PartReference  22R  [R400]
=R__20_PartReference  3.3k  [R400]
=R__21_PartReference  0.01R  [R400]
=R__22_PartReference  3.3k  [R400]
=R__PartReference  470R  [R400]

### Ports
IV (out), IW (out), PWM1H (in), PWM1L (in), PWM2H (in), PWM2L (in), PWM3H (in), PWM3L (in), U (out), V (out), W (out)

### Nets
+3.3V: =IC__5_PartReference.1(VCC) =IC__5_PartReference.13(MODE)
+3.3VA: =C__10_PartReference.1 =IC__3_PartReference.8(+VCC) =IC__4_PartReference.8(+VCC)
+12V: =C__1_PartReference.1 =C__7_PartReference.1 =C__PartReference.1 =D__1_PartReference.1(a) =D__2_PartReference.1(a) =D__PartReference.1(a) =IC__1_PartReference.1(VCC) =IC__2_PartReference.1(VCC) =IC__PartReference.1(VCC) =R__3_PartReference.2
AGND: =C__5_PartReference.2 =C__6_PartReference.2 =C__10_PartReference.2 =IC__3_PartReference.4(-VCC) =IC__4_PartReference.4(-VCC)
GND: =IC__5_PartReference.8(GND)
PGND: =C__1_PartReference.2 =C__7_PartReference.2 =C__11_PartReference.2 =C__PartReference.2 =IC__1_PartReference.4(COM) =IC__2_PartReference.4(COM) =IC__PartReference.4(COM) =Q__1_PartReference.S1(S) =Q__1_PartReference.S2(S) =R__2_PartReference.1 =R__12_PartReference.2
PVCC2: =C__11_PartReference.1 =Q__3_PartReference.D1(D) =Q__3_PartReference.D2(D) =Q__3_PartReference.D3(D) =Q__3_PartReference.D4(D) =Q__4_PartReference.D1(D) =Q__4_PartReference.D2(D) =Q__4_PartReference.D3(D) =Q__4_PartReference.D4(D) =Q__PartReference.D1(D) =Q__PartReference.D2(D) =Q__PartReference.D3(D) =Q__PartReference.D4(D)
REF 1.5: =R__5_PartReference.1 =R__22_PartReference.1
IV: =C__5_PartReference.1 =R__6_PartReference.2 ; port IV
IW: =C__6_PartReference.1 =R__16_PartReference.2 ; port IW
Mes_Ipwm1: =Q__5_PartReference.S1(S) =Q__5_PartReference.S2(S) =R__1_PartReference.1 =R__12_PartReference.1
Mes_Ipwm2: =Q__2_PartReference.S1(S) =Q__2_PartReference.S2(S) =R__21_PartReference.1 =R__PartReference.1
PWM1_HO: =Q__PartReference.G =R__17_PartReference.2
PWM1_LO: =Q__5_PartReference.G =R__19_PartReference.2
PWM1_RO: =C__9_PartReference.2 =IC__2_PartReference.6(VS) =Q__5_PartReference.D1(D) =Q__5_PartReference.D2(D) =Q__5_PartReference.D3(D) =Q__5_PartReference.D4(D) =Q__PartReference.S1(S) =Q__PartReference.S2(S) ; port U
PWM1H: =IC__5_PartReference.3(AI) ; port PWM1H
PWM1L: =IC__5_PartReference.5(BI) ; port PWM1L
PWM2_HO: =Q__3_PartReference.G =R__7_PartReference.2
PWM2_LO: =Q__2_PartReference.G =R__10_PartReference.2
PWM2_RO: =C__4_PartReference.2 =IC__PartReference.6(VS) =Q__2_PartReference.D1(D) =Q__2_PartReference.D2(D) =Q__2_PartReference.D3(D) =Q__2_PartReference.D4(D) =Q__3_PartReference.S1(S) =Q__3_PartReference.S2(S) ; port V
PWM2H: =IC__5_PartReference.7(CI) ; port PWM2H
PWM2L: =IC__5_PartReference.9(DI) ; port PWM2L
PWM3_HO: =Q__4_PartReference.G =R__15_PartReference.2
PWM3_LO: =Q__1_PartReference.G =R__4_PartReference.2
PWM3_RO: =C__3_PartReference.2 =IC__1_PartReference.6(VS) =Q__1_PartReference.D3(D) =Q__1_PartReference.D4(D) ; port W
PWM3H: =IC__5_PartReference.11(EI) ; port PWM3H
PWM3L: =IC__5_PartReference.14(FI) ; port PWM3L
Net=C__2_PartReference_1: =C__2_PartReference.1 =R__13_PartReference.1 =R__PartReference.2
Net=C__2_PartReference_2: =C__2_PartReference.2 =R__9_PartReference.1 =R__11_PartReference.2
Net=C__3_PartReference_1: =C__3_PartReference.1 =D__PartReference.3(k) =IC__1_PartReference.8(VB)
Net=C__4_PartReference_1: =C__4_PartReference.1 =D__1_PartReference.3(k) =IC__PartReference.8(VB)
Net=C__8_PartReference_1: =C__8_PartReference.1 =R__1_PartReference.2 =R__8_PartReference.1
Net=C__8_PartReference_2: =C__8_PartReference.2 =R__2_PartReference.2 =R__14_PartReference.1
Net=C__9_PartReference_1: =C__9_PartReference.1 =D__2_PartReference.3(k) =IC__2_PartReference.8(VB)
Net=IC__1_PartReference_2: =IC__1_PartReference.2(~{HIN}) =IC__5_PartReference.12(EO)
Net=IC__1_PartReference_3: =IC__1_PartReference.3(~{LIN}) =IC__5_PartReference.15(FO)
Net=IC__1_PartReference_5: =IC__1_PartReference.5(LO) =R__4_PartReference.1
Net=IC__1_PartReference_7: =IC__1_PartReference.7(HO) =R__15_PartReference.1
Net=IC__2_PartReference_2: =IC__2_PartReference.2(~{HIN}) =IC__5_PartReference.2(AO)
Net=IC__2_PartReference_3: =IC__2_PartReference.3(~{LIN}) =IC__5_PartReference.4(BO)
Net=IC__2_PartReference_5: =IC__2_PartReference.5(LO) =R__19_PartReference.1
Net=IC__2_PartReference_7: =IC__2_PartReference.7(HO) =R__17_PartReference.1
Net=IC__3_PartReference_1: =IC__3_PartReference.1(OUT) =R__16_PartReference.1 =R__20_PartReference.2
Net=IC__3_PartReference_2: =IC__3_PartReference.2(-IN) =R__8_PartReference.2 =R__20_PartReference.1
Net=IC__3_PartReference_3: =IC__3_PartReference.3(+IN) =R__14_PartReference.2 =R__22_PartReference.2
Net=IC__4_PartReference_1: =IC__4_PartReference.1(OUT) =R__6_PartReference.1 =R__18_PartReference.2
Net=IC__4_PartReference_2: =IC__4_PartReference.2(-IN) =R__13_PartReference.2 =R__18_PartReference.1
Net=IC__4_PartReference_3: =IC__4_PartReference.3(+IN) =R__5_PartReference.2 =R__9_PartReference.2
Net=IC__5_PartReference_6: =IC__5_PartReference.6(CO) =IC__PartReference.2(~{HIN})
Net=IC__5_PartReference_10: =IC__5_PartReference.10(DO) =IC__PartReference.3(~{LIN})
Net=IC__5_PartReference_16: =IC__5_PartReference.16(VDD) =R__3_PartReference.1
Net=IC__PartReference_5: =IC__PartReference.5(LO) =R__10_PartReference.1
Net=IC__PartReference_7: =IC__PartReference.7(HO) =R__7_PartReference.1
Net=Q__1_PartReference_D1: =Q__1_PartReference.D1(D) =Q__4_PartReference.S1(S)
Net=Q__1_PartReference_D2: =Q__1_PartReference.D2(D) =Q__4_PartReference.S2(S)
Net=R__11_PartReference_1: =R__11_PartReference.1 =R__21_PartReference.2

### Channels
H-Bridge3: designators end in _H-Bridge3; ports IV=I4 IW=I3 PWM1H=PWM8 PWM1L=PWM7 PWM2H=PWM10 PWM2L=PWM9 PWM3H=PWM12 PWM3L=PWM11 U=PWM1_RO V=PWM2_RO W=PWM3_RO
H-Bridge2: designators end in _H-Bridge2; ports IV=I2 IW=I1 PWM1H=PWM2 PWM1L=PWM1 PWM2H=PWM4 PWM2L=PWM3 PWM3H=PWM6 PWM3L=PWM5 U=PWM1_RO V=PWM2_RO W=PWM3_RO

### Notes on the sheet
- (near =R__12_PartReference) SHUNT
- (near =R__21_PartReference) SHUNT
- PONT EN H TRIPHASE
- Labels drawn without touching a wire or pin: PGND
- HES-SO / HEIG-VD / TIN / IAI
  Route de Cheseaux, 1
  CH-1401 Yverdon-les-Bains
  T +41 24 557 73 77    F +41 24 557 63 20
  http://iai.heig-vd.ch
  iai@heig-vd.ch
- Title
- Size
- Date
- A4
- Project
- Sheet
- of
- No.
- Author
- SVN/Git
- Version
- File
- (in symbol OPA2340_2, part A) -; +

### Library data of the parts
=C__1_PartReference =C__7_PartReference =C__PartReference = C_Dup1: Tolérance: 10%; Prix: 0.154; Ref. Fabricant: 2238 910 15649; Fabricant: PHYCOMP; Quantité min: 10; PCB Footprint: HEIG/SM/C_0805; Ref. Distributeur: 644249; Distributeur: Farnell
=C__2_PartReference =C__8_PartReference = C_Dup1: Tolérance: 5%; Ref. Fabricant: GRM1885C1H102JA01DMURATA; Prix: 0.153; Fabricant: MURATA; Quantité min: 10; PCB Footprint: HEIG/SM/C_0603; Distributeur: Farnell; Ref. Distributeur: 8819920
=C__3_PartReference =C__4_PartReference = C_Dup1: Tolérance: 10%; Prix: 0.7; Ref. Fabricant: 08051C104KAZ2A; Fabricant: AVX; Quantité min: 5; PCB Footprint: HEIG/SM/C_0805; Ref. Distributeur: 1301805; Distributeur: Farnell
=C__5_PartReference =C__6_PartReference =C__10_PartReference = C_Dup1: Ref. Fabricant: GRM188R71H103KA01D; Prix: 0.071; Fabricant: MURATA; Quantité min: 10; PCB Footprint: HEIG/SM/C_0603; Ref. Distributeur: 8819980; Distributeur: Farnell
=C__9_PartReference = C_Dup1: Tolérance: 10%; Quantité min: 5; Fabricant: AVX; Ref. Fabricant: 08051C104KAZ2A; Prix: 0.7; PCB Footprint: HEIG/SM/C_0805; Distributeur: Farnell; Ref. Distributeur: 1301805
=C__11_PartReference = C_Dup1: PCB Footprint: MKP1837-410; Prix: 2.10; Ref. Fabricant: MKP1837-410-161-G; Fabricant: VISHAY ROEDERSTEIN; Quantité min: 5; Distributeur: Farnell; Ref. Distributeur: 1166887
=D__1_PartReference = D_2: Quantité min: 10; Fabricant: NXP; Prix: 0.196; Voltage: 85V; PCB Footprint: HEIG/SM/SOT23; Ref. Distributeur: 1081180; Ref. Fabricant: BAS16; Distributeur: Farnell
=D__2_PartReference = D_4: Quantité min: 10; Fabricant: NXP; Prix: 0.196; Voltage: 85V; Ref. Distributeur: 1081180; Ref. Fabricant: BAS16; Distributeur: Farnell; PCB Footprint: HEIG/SM/SOT23
=D__PartReference = D_3: Voltage: 85V; Prix: 0.196; Fabricant: NXP; Quantité min: 10; PCB Footprint: HEIG/SM/SOT23; Distributeur: Farnell; Ref. Fabricant: BAS16; Ref. Distributeur: 1081180
=IC__1_PartReference =IC__2_PartReference = IR2102/SO_0: Quantité min: 1; Fabricant: INTERNATIONAL RECTIFIER; Prix: 8.10; PCB Footprint: SOG.050/8/WG.244/L.200; Ref. Distributeur: 9101829; Ref. Fabricant: IR2102SPBF; Distributeur: Farnell
=IC__3_PartReference =IC__4_PartReference = OPA2340_2: Prix: 7.20; Fabricant: TEXAS INSTRUMENTS; Quantité min: 1; PCB Footprint: HEIG/SM/MSOP8; Ref. Distributeur: 1097493; Ref. Fabricant: OPA2350EA/250; Distributeur: Farnell
=IC__5_PartReference = CD4504BMS_1: Ref. Fabricant: MC14504BDG; Prix: 2.60; FPLIST: SOG.050/16/WG.420/L.425; Fabricant: ON SEMICONDUCTOR; Quantité min: 1; Distributeur: Farnell; Ref. Distributeur: 9665218; PCB Footprint: SOG.050/16/WG.244/L.400
=IC__PartReference = IR2102/SO_0_Dup1: Prix: 8.10; Fabricant: INTERNATIONAL RECTIFIER; Quantité min: 1; Distributeur: Farnell; Ref. Fabricant: IR2102SPBF; Ref. Distributeur: 9101829; PCB Footprint: SOG.050/8/WG.244/L.200
=Q__1_PartReference = IRF3710S/SM_0: Prix: 8.75; Fabricant: INTERNATIONAL RECTIFIER; Quantité min: 1; Ref. Distributeur: 1078423; Ref. Fabricant: IRF6644TR1; Distributeur: Farnell; PCB Footprint: HEIG/DIRECTFET/MN
=Q__2_PartReference =Q__3_PartReference =Q__4_PartReference =Q__5_PartReference =Q__PartReference = IRF3710S/SM_0: Quantité min: 1; Prix: 8.75; Fabricant: INTERNATIONAL RECTIFIER; Ref. Distributeur: 1078423; Ref. Fabricant: IRF6644TR1; Distributeur: Farnell; PCB Footprint: HEIG/DIRECTFET/MN
=R__1_PartReference =R__2_PartReference =R__11_PartReference =R__PartReference = R_Dup1: Tolérance: 5%; PCB Footprint: HEIG/SM/R_0603; Prix: 0.064; Ref. Fabricant: MC 0.063W 0603 5% 470R; Fabricant: MULTICOMP; Quantité min: 50; Distributeur: Farnell; Ref. Distributeur: 9332146
=R__3_PartReference = R_Dup1: PCB Footprint: SM/R_0805; Ref. Fabricant: MC 0.1W 0805 5% 100R; Prix: 0.064; Fabricant: MULTICOMP; Quantité min: 50; Tolérance: 5%; Distributeur: Farnell; Ref. Distributeur: 9333703
=R__4_PartReference =R__7_PartReference =R__10_PartReference =R__15_PartReference =R__17_PartReference =R__19_PartReference = R_Dup1: Tolérance: 5%; PCB Footprint: SM/R_0805; Prix: 0.064; Ref. Fabricant: MC 0.1W 0805 5% 22R; Fabricant: MULTICOMP; Quantité min: 50; Distributeur: Farnell; Ref. Distributeur: 9334122
=R__5_PartReference =R__20_PartReference =R__22_PartReference = R_Dup1: Quantité min: 50; Fabricant: MULTICOMP; Ref. Fabricant: MC 0.063W 0603 5% 12K; Prix: 0.064; Tolérance: 5%; PCB Footprint: HEIG/SM/R_0603; Ref. Distributeur: 9331760; Distributeur: Farnell
=R__6_PartReference =R__16_PartReference = R_Dup1: PCB Footprint: HEIG/SM/R_0603; Prix: 0.064; Ref. Fabricant: MC 0.063W 0603 5% 22R; Fabricant: MULTICOMP; Quantité min: 50; Ref. Distributeur: 9331891; Distributeur: Farnell
=R__8_PartReference =R__9_PartReference =R__14_PartReference = R_Dup1: Tolérance: 5%; PCB Footprint: HEIG/SM/R_0603; Prix: 0.064; Ref. Fabricant: MC 0.063W 0603 5% 330R; Quantité min: 50; Fabricant: MULTICOMP; Distributeur: Farnell; Ref. Distributeur: 9332014
=R__12_PartReference =R__21_PartReference = R_Dup1: Tolérance: 1%; Voltage: 200V; PCB Footprint: SM/R_2010; Prix: 3.40; Ref. Fabricant: LRF2010-R01FW; Fabricant: WELMYN; Quantité min: 5; Ref. Distributeur: 1100044; Distributeur: Farnell
=R__13_PartReference = R_Dup1: Tolérance: 5%; PCB Footprint: HEIG/SM/R_0603; Prix: 0.064; Ref. Fabricant: MC 0.063W 0603 5% 330R; Fabricant: MULTICOMP; Quantité min: 50; Distributeur: Farnell; Ref. Distributeur: 9332014
=R__18_PartReference = R_Dup1: Tolérance: 5%; Prix: 0.064; Ref. Fabricant: MC 0.063W 0603 5% 12K; Fabricant: MULTICOMP; Quantité min: 50; PCB Footprint: HEIG/SM/R_0603; Distributeur: Farnell; Ref. Distributeur: 9331760

## Nets that join several sheets
+3.3V: PowerSupply (27 pins), Interfaces (29 pins), DSP (40 pins), H-Bridge3 (=IC__5_PartReference_H-Bridge3.1 =IC__5_PartReference_H-Bridge3.13), H-Bridge2 (=IC__5_PartReference_H-Bridge2.1 =IC__5_PartReference_H-Bridge2.13)
+3.3VA: PowerSupply (9 pins), Interfaces (C48.1 C50.1 IC13.1 IC14.5), INERTIAL (5 pins), H-Bridge3 (=C__10_PartReference_H-Bridge3.1 =IC__3_PartReference_H-Bridge3.8 =IC__4_PartReference_H-Bridge3.8), H-Bridge2 (=C__10_PartReference_H-Bridge2.1 =IC__3_PartReference_H-Bridge2.8 =IC__4_PartReference_H-Bridge2.8)
+5V: PowerSupply (18 pins), Interfaces (18 pins)
+12V: PowerSupply (6 pins), H-Bridge3 (10 pins), H-Bridge2 (10 pins)
AGND: PowerSupply (17 pins), Interfaces (6 pins), DSP (7 pins), INERTIAL (14 pins), H-Bridge3 (5 pins), H-Bridge2 (5 pins)
GND: PowerSupply (69 pins), Interfaces (49 pins), DSP (50 pins), H-Bridge3 (=IC__5_PartReference_H-Bridge3.8), H-Bridge2 (=IC__5_PartReference_H-Bridge2.8)
PGND: PowerSupply (7 pins), H-Bridge3 (11 pins), H-Bridge2 (11 pins)
PVCC2: PowerSupply (IC2.3 R1.2), H-Bridge3 (13 pins), H-Bridge2 (13 pins)
REF 1.5: PowerSupply (IC4#2.3), Interfaces (IC14.4 R37.1), DSP (IC6.J5 IC6.L5), H-Bridge3 (=R__5_PartReference_H-Bridge3.1 =R__22_PartReference_H-Bridge3.1), H-Bridge2 (=R__5_PartReference_H-Bridge2.1 =R__22_PartReference_H-Bridge2.1)
12V MONITOR: PowerSupply (IC4#1.1 R13.2), DSP (IC6.H3)
HALL0: Interfaces (IC11#1.2), DSP (IC6.G11)
HALL1: Interfaces (IC11#2.2), DSP (IC6.G13)
HALL2: Interfaces (IC11#3.2), DSP (IC6.G12)
HALL3: Interfaces (IC11#4.2), DSP (IC6.G14)
HALL4: Interfaces (IC11#5.2), DSP (IC6.H14)
HALL5: Interfaces (IC11#6.2), DSP (IC6.K12)
I1: DSP (IC6.M3), H-Bridge2 (=C__6_PartReference_H-Bridge2.1 =R__16_PartReference_H-Bridge2.2)
I2: DSP (IC6.P2), H-Bridge2 (=C__5_PartReference_H-Bridge2.1 =R__6_PartReference_H-Bridge2.2)
I3: DSP (IC6.N1), H-Bridge3 (=C__6_PartReference_H-Bridge3.1 =R__16_PartReference_H-Bridge3.2)
I4: DSP (IC6.N3), H-Bridge3 (=C__5_PartReference_H-Bridge3.1 =R__6_PartReference_H-Bridge3.2)
IO0: Interfaces (Q1.1), DSP (IC6.K13)
IO1: Interfaces (Q2.1), DSP (IC6.K11)
IO2: Interfaces (Q3.1), DSP (IC6.L14)
IO3: Interfaces (IC12#1.2), DSP (IC6.L13)
IO4: Interfaces (IC12#2.2), DSP (IC6.L12)
IO5: Interfaces (IC12#3.2), DSP (IC6.M14)
IO6: Interfaces (IC12#4.2), DSP (IC6.M13)
IO7: Interfaces (IC12#5.2), DSP (IC6.P14)
IO8: Interfaces (IC12#6.2), DSP (IC6.N13)
NetC51_1: Interfaces (C51.1 IC16.3 IC16.4), DSP (IC6.K4)
NetC57_1: Interfaces (X8.3), DSP (C57.1 R49.2)
NetC57_2: Interfaces (X8.1), DSP (C57.2 R50.2)
NetC63_1: DSP (IC6.M1), INERTIAL (C63.1 R56.2)
NetC65_1: DSP (IC6.P3), INERTIAL (C65.1 R57.2)
NetC68_1: DSP (IC6.L4), INERTIAL (C68.1 R58.2)
NetIC6_H2: Interfaces (R34.1), DSP (IC6.H2)
NetIC6_K7: Interfaces (IC15.1), DSP (IC6.K7)
NetIC6_K8: Interfaces (IC9#6.2), DSP (IC6.K8)
NetIC6_L6: Interfaces (IC15.4), DSP (IC6.L6)
NetIC6_L7: Interfaces (IC9#1.2), DSP (IC6.L7)
NetIC6_M7: Interfaces (IC9#3.2), DSP (IC6.M7)
NetIC6_M8: Interfaces (IC9#4.2), DSP (IC6.M8)
NetIC6_N7: DSP (IC6.N7), INERTIAL (IC23.2)
NetIC6_N8: Interfaces (IC9#5.2), DSP (IC6.N8)
NetIC6_N9: Interfaces (X7.2), DSP (IC6.N9 IC20.5 R54.2)
NetIC6_P7: Interfaces (IC9#2.2), DSP (IC6.P7)
NetIC6_P9: Interfaces (X7.3), DSP (IC6.P9 IC20.6 R53.2)
NetIC18_91: Interfaces (X8.4), DSP (IC18.91 R47.2)
NetIC18_92: Interfaces (X8.6), DSP (IC18.92 R47.1)
NetIC18_99: Interfaces (R23.1), DSP (IC18.99)
NetIC18_100: Interfaces (R24.1), DSP (IC18.100)
OVERLOAD: PowerSupply (IC4#2.1 R5.2), DSP (IC6.G3)
PWM1: DSP (IC6.C1 R42.1), H-Bridge2 (=IC__5_PartReference_H-Bridge2.5)
PWM1_RO: Interfaces (X5.1), H-Bridge3 (8 pins)
PWM1_RO: Interfaces (X3.1), H-Bridge2 (8 pins)
PWM2: DSP (IC6.D3 R43#1.1), H-Bridge2 (=IC__5_PartReference_H-Bridge2.3)
PWM2_RO: Interfaces (X5.3), H-Bridge3 (8 pins)
PWM2_RO: Interfaces (X3.3), H-Bridge2 (8 pins)
PWM3: DSP (IC6.D2 R43#2.1), H-Bridge2 (=IC__5_PartReference_H-Bridge2.9)
PWM3_RO: Interfaces (X5.5), H-Bridge3 (=C__3_PartReference_H-Bridge3.2 =IC__1_PartReference_H-Bridge3.6 =Q__1_PartReference_H-Bridge3.D3 =Q__1_PartReference_H-Bridge3.D4)
PWM3_RO: Interfaces (X3.5), H-Bridge2 (=C__3_PartReference_H-Bridge2.2 =IC__1_PartReference_H-Bridge2.6 =Q__1_PartReference_H-Bridge2.D3 =Q__1_PartReference_H-Bridge2.D4)
PWM4: DSP (IC6.E4 R43#3.1), H-Bridge2 (=IC__5_PartReference_H-Bridge2.7)
PWM5: DSP (IC6.E2 R43#4.1), H-Bridge2 (=IC__5_PartReference_H-Bridge2.14)
PWM6: DSP (IC6.E3 R44#1.1), H-Bridge2 (=IC__5_PartReference_H-Bridge2.11)
PWM7: DSP (IC6.E1 R44#2.1), H-Bridge3 (=IC__5_PartReference_H-Bridge3.5)
PWM8: DSP (IC6.F2 R44#3.1), H-Bridge3 (=IC__5_PartReference_H-Bridge3.3)
PWM9: DSP (IC6.F1 R44#4.1), H-Bridge3 (=IC__5_PartReference_H-Bridge3.9)
PWM10: DSP (IC6.G5 R45#1.1), H-Bridge3 (=IC__5_PartReference_H-Bridge3.7)
PWM11: DSP (IC6.G4 R45#2.1), H-Bridge3 (=IC__5_PartReference_H-Bridge3.14)
PWM12: DSP (IC6.G2 R45#3.1), H-Bridge3 (=IC__5_PartReference_H-Bridge3.11)
PWR MONITOR: PowerSupply (IC7.4 R20.2), DSP (IC6.M4)